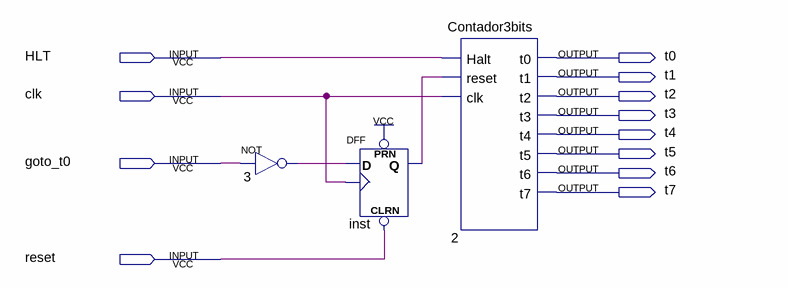
[diagram p0: schematic sheet]
// Quartus schematic Temporizador.bdf as structural Verilog: 3 symbols, 12 pins
module Temporizador (
  input  HLT,
  input  clk,
  input  goto_t0,
  input  reset,
  output t0,
  output t1,
  output t2,
  output t3,
  output t4,
  output t5,
  output t6,
  output t7
);

  wire inst_q, n3_out;

  not u_3 (n3_out, goto_t0);
  DFF inst (.CLRN(reset), .CLK(clk), .D(n3_out), .PRN(1'b1), .Q(inst_q));
  Contador3bits u_2 (
    .Halt(HLT), .reset(inst_q), .clk(clk), .t0(t0), .t1(t1), .t2(t2), .t3(t3), .t4(t4), .t5(t5), .t6(t6),
    .t7(t7));
endmodule
